# Altium project 移位寄存器走马灯_Project.PrjPcb
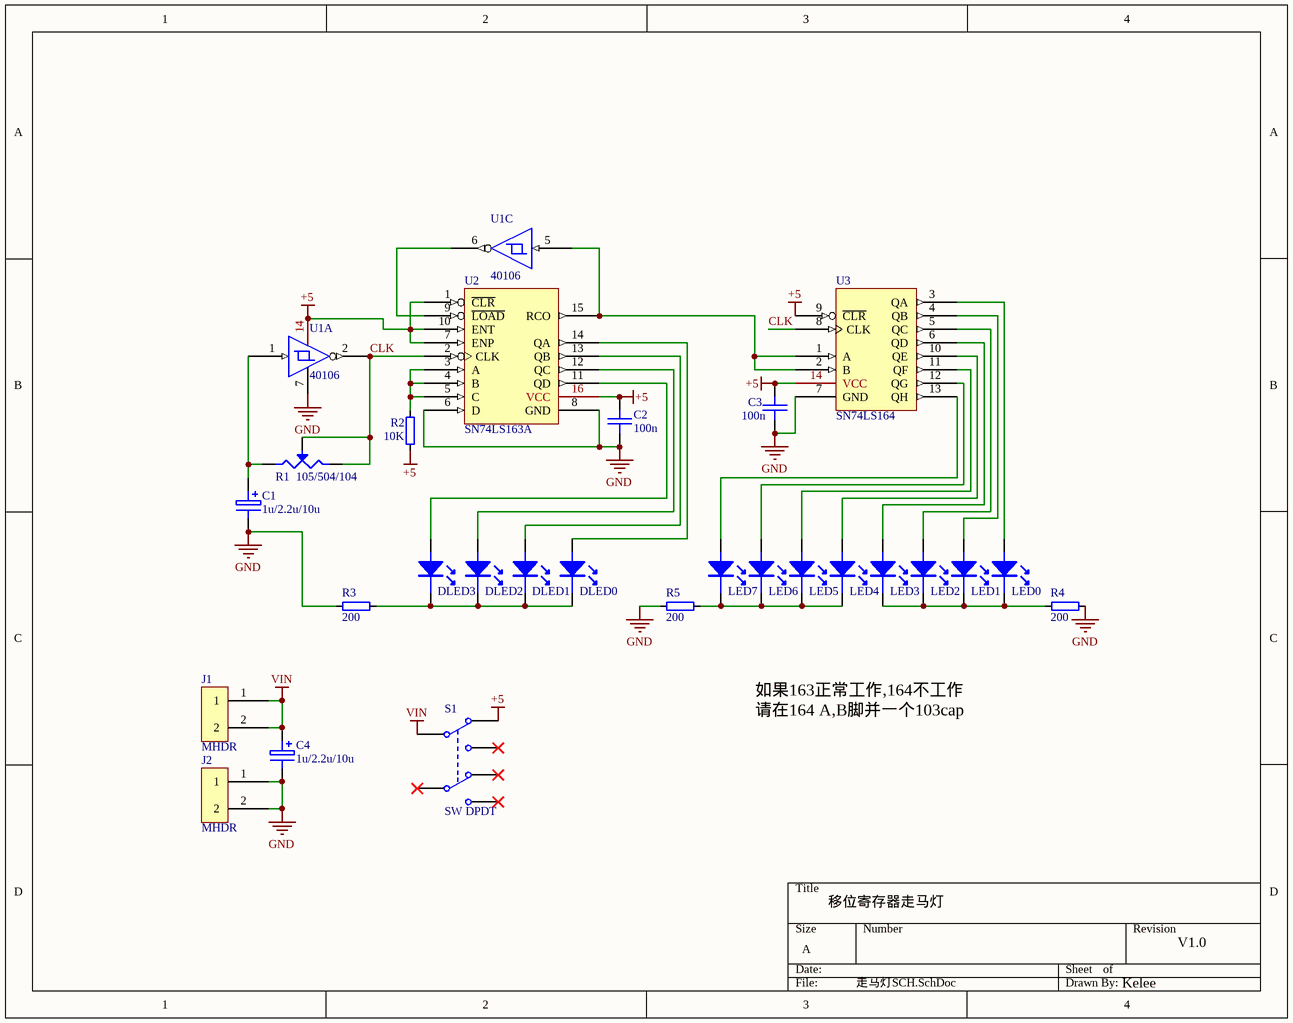
[diagram p0: 走马灯SCH.SchDoc]
1 sheet, 27 parts. Net scope: global (net labels, ports and power ports of the same name join across sheets).
Board file: 走马灯PCB.PcbDoc

## Sheet 走马灯SCH.SchDoc
size A

### Parts
C1  1u/2.2u/10u  [C5X8]
C2  100n  [MLCC5.08-A]
C3  100n  [MLCC5.08-A]
C4  1u/2.2u/10u  [C5X8]
DLED0  D-LED  [LED 5MM-Y]  (value not drawn)
DLED1  D-LED  [LED 5MM-Y]  (value not drawn)
DLED2  D-LED  [LED 5MM-Y]  (value not drawn)
DLED3  D-LED  [LED 5MM-Y]  (value not drawn)
J1  MHDR  [HDR1X2]
J2  MHDR  [HDR1X2]
LED0  LED  [LED 5MM-R]  (value not drawn)
LED1  LED  [LED 5MM-R]  (value not drawn)
LED2  LED  [LED 5MM-R]  (value not drawn)
LED3  LED  [LED 5MM-R]  (value not drawn)
LED4  LED  [LED 5MM-R]  (value not drawn)
LED5  LED  [LED 5MM-R]  (value not drawn)
LED6  LED  [LED 5MM-R]  (value not drawn)
LED7  LED  [LED 5MM-R]  (value not drawn)
R1  105/504/104  [RES ADJ3]
R2  10K  [RS 1/4W]
R3  200  [RS 1/4W]
R4  200  [RS 1/4W]
R5  200  [RS 1/4W]
S1  SW DPDT  [KFT DIP-8X8]
U1  40106  [DIP14]  (parts A,C of 6)
U2  SN74LS163A  [DIP16]
U3  SN74LS164  [DIP14]

### Nets
+5: C2.2 C3.2 R2.2 S1.1(NC1) U1.14(Vdd) U2.1(~{CLR}) U2.7(ENP) U2.10(ENT) U2.16(VCC) U3.9(~{CLR}) U3.14(VCC)
GND: C1.2 C2.1 C3.1 C4.2 J2.1 J2.2 R3.1 R4.2 R5.1 U1.7(GND) U2.6(D) U2.8(GND) U3.7(GND)
VCC: U1.14(VCC) U2.16(VCC) U3.14(VCC)
VIN: C4.1 J1.1 J1.2 S1.3(COMMON1)
CLK: R1.2 R1.3(W) U1.2 U2.2(CLK) U3.8(CLK)
NetC1_1: C1.1 R1.1 U1.1
NetDLED0_1: DLED0.1(A) U2.14(QA)
NetDLED0_2: DLED0.2(K) DLED1.2(K) DLED2.2(K) DLED3.2(K) R3.2
NetDLED1_1: DLED1.1(A) U2.13(QB)
NetDLED2_1: DLED2.1(A) U2.12(QC)
NetDLED3_1: DLED3.1(A) U2.11(QD)
NetLED0_1: LED0.1(A) U3.3(QA)
NetLED0_2: LED0.2(K) LED1.2(K) LED2.2(K) LED3.2(K) R4.1
NetLED1_1: LED1.1(A) U3.4(QB)
NetLED2_1: LED2.1(A) U3.5(QC)
NetLED3_1: LED3.1(A) U3.6(QD)
NetLED4_1: LED4.1(A) U3.10(QE)
NetLED4_2: LED4.2(K) LED5.2(K) LED6.2(K) LED7.2(K) R5.2
NetLED5_1: LED5.1(A) U3.11(QF)
NetLED6_1: LED6.1(A) U3.12(QG)
NetLED7_1: LED7.1(A) U3.13(QH)
NetR2_1: R2.1 U2.3(A) U2.4(B) U2.5(C)
NetU1_5: U1.5 U2.15(RCO) U3.1(A) U3.2(B)
NetU1_6: U1.6 U2.9(~{LOAD})

Not connected (* = marked no-connect by the designer): S1 2(NO1)* 4(NC2)* 5(NO2)* 6(COMMON2)*

### Notes on the sheet
- 如果163正常工作,164不工作
- 请在164 A,B脚并一个103cap
- 移位寄存器走马灯
- V1.0
- Kelee

### Library data of the parts
C1 C4 = CAP-E: 电解电容
C2 C3 = CAP-M: 独石电容
DLED0-DLED3 = D-LED: LED
J1 J2 = MHDR1x2
R1 = R-GLIDE
R2 = R-10K: resistor
R3-R5 = R-200: resistor
S1 = SW DPDT: Switch; Published: 24-Mar-1999; LatestRevisionDate: 17-Jul-2002; LatestRevisionNote: Re-released for DXP Platform.; PackageReference: SOT23-6; Publisher: Altium Limited
U1 = CD40106
U2 = SN74LS163A: SYN 4-BIT CNT
U3 = SN74LS164: 8-BIT PALL SERI SFT REG